# EAGLE design RGB_i2c_v1plusRTC (EAGLE 6.5.0)
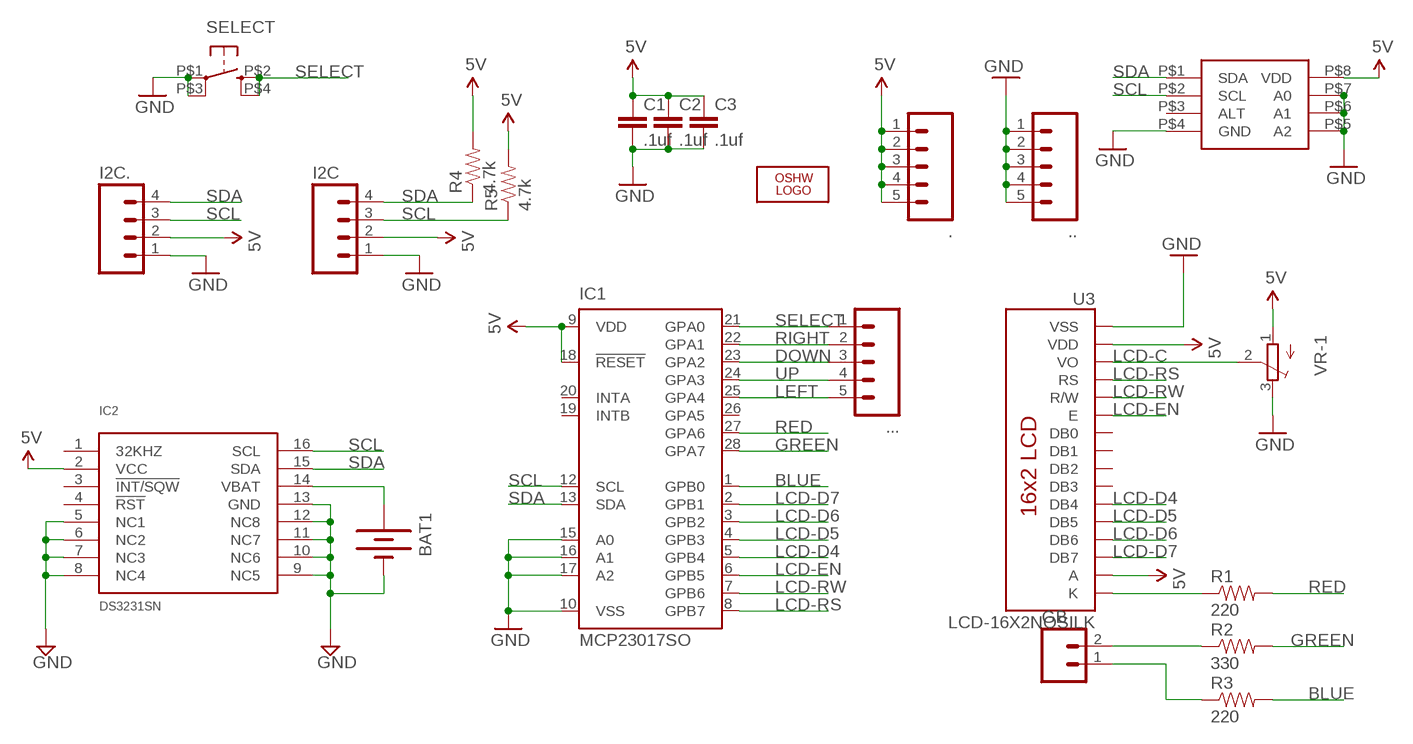
[diagram p0: schematic, sheet 1]

## Parts
.  M05LOCK  [1X05_LOCK]
..  M05LOCK  [1X05_LOCK]
...  M05LOCK  [1X05_LOCK]
BAT1  BATTERY12MM  [BATTCON_12MM]
C1  .1uf  CAP0805  [0805]
C2  .1uf  CAP0805  [0805]
C3  .1uf  CAP0805  [0805]
GB  M02LOCK  [1X02_LOCK]
I2C  M04LOCK  [1X04_LOCK]
I2C.  M04LOCK  [1X04_LOCK]
IC1  MCP23017SO  [SO28W]
IC2  DS3231SN  [SO16W]
IC3  MCP9808  [MSOP8]
LOGO2  OSHW_LOGO_10MILX0350-NT  [OSHW_10X350_NOTEXT]
R1  220  RESISTOR0805-RES  [0805]
R2  330  RESISTOR0805-RES  [0805]
R3  220  RESISTOR0805-RES  [0805]
R4  4.7k  RESISTOR0805-RES  [0805]
R5  4.7k  RESISTOR0805-RES  [0805]
SELECT  KMR211GLFS  BUTTON-KMR241GLFS  [PUSHBUTTON-KMR241GLFS]
U3  LCD-16X2NOSILK  [LCD-16X2_NOSILK]
VR-1  TRIMPOTTC33X  [TC33X]

## Nets
5V: ..1 ..2 ..3 ..4 ..5 C1.1 C2.1 C3.1 I2C.2 I2C..2 IC1.9(VDD) IC1.18(!RESET) IC2.2(VCC) IC3.P$8(VDD) R4.2 R5.2 U3.2(VDD) U3.15(A) VR-1.1(A)
BLUE: IC1.1(GPB0) R3.2
DOWN: ....3 IC1.23(GPA2)
GND: ...1 ...2 ...3 ...4 ...5 BAT1.GND(-) C1.2 C2.2 C3.2 I2C.1 I2C..1 IC1.10(VSS) IC1.15(A0) IC1.16(A1) IC1.17(A2) IC2.5(NC1) IC2.6(NC2) IC2.7(NC3) IC2.8(NC4) IC2.9(NC5) IC2.10(NC6) IC2.11(NC7) IC2.12(NC8) IC2.13(GND) IC3.P$4(GND) SELECT.P$1 SELECT.P$3 U3.1(VSS) VR-1.3(E)
GREEN: IC1.28(GPA7) R2.2
LCD-C: U3.3(VO) VR-1.2(S)
LCD-D4: IC1.5(GPB4) U3.11(DB4)
LCD-D5: IC1.4(GPB3) U3.12(DB5)
LCD-D6: IC1.3(GPB2) U3.13(DB6)
LCD-D7: IC1.2(GPB1) U3.14(DB7)
LCD-EN: IC1.6(GPB5) U3.6(E)
LCD-RS: IC1.8(GPB7) U3.4(RS)
LCD-RW: IC1.7(GPB6) U3.5(R/W)
LEFT: ....5 IC1.25(GPA4)
N$1: GB.2 R2.1
N$2: GB.1 R3.1
N$3: BAT1.PWR@1(+) IC2.14(VBAT)
N$4: R1.1 U3.16(K)
N$6: IC3.P$5(A2) IC3.P$6(A1) IC3.P$7(A0) ; supply symbol labelled GND
RED: IC1.27(GPA6) R1.2
RIGHT: ....2 IC1.22(GPA1)
SCL: I2C.3 I2C..3 IC1.12(SCL) IC2.16(SCL) IC3.P$2(SCL) R5.1
SDA: I2C.4 I2C..4 IC1.13(SDA) IC2.15(SDA) IC3.P$1(SDA) R4.1
SELECT: ....1 IC1.21(GPA0) SELECT.P$2 SELECT.P$4
UP: ....4 IC1.24(GPA3)
Unconnected: IC1.19(INTB) IC1.20(INTA) IC1.26(GPA5) IC2.1(32KHZ) IC2.3(!INT/SQW) IC2.4(!RST) IC3.P$3(ALT) U3.7(DB0) U3.8(DB1) U3.9(DB2) U3.10(DB3)

## Library data of the parts
. .. ... = SparkFun:M05: Header 5 Standard 5-pin 0.1" header. Use with straight break away headers (SKU : PRT-00116), right angle break away headers (PRT-00553), swiss pins (PRT-00743), machine pins (PRT-00117), and female headers (PRT-00115). Molex polarized connector foot print use with SKU : PRT-08230 with associated crimp pins and housings.
BAT1 = SparkFun:BATTERY: Battery Holders Various common sizes : AA, AAA, 20mm coin cell and 12mm coin cell.
C1-C3 = SparkFun:CAP: Capacitor Standard 0603 ceramic capacitor, and 0.1" leaded capacitor.
GB = SparkFun:M02: Header 2 Standard 2-pin 0.1" header. Use with straight break away headers (SKU : PRT-00116), right angle break away headers (PRT-00553), swiss pins (PRT-00743), machine pins (PRT-00117), and female headers (PRT-00115). Molex polarized connector foot print use with SKU : PRT-08233 with associated crimp pins and housings.
I2C I2C. = SparkFun:M04: Header 4 Standard 4-pin 0.1" header. Use with straight break away headers (SKU : PRT-00116), right angle break away headers (PRT-00553), swiss pins (PRT-00743), machine pins (PRT-00117), and female headers (PRT-00115). Molex polarized connector foot print use with SKU : PRT-08231 with associated crimp pins and housings. 1MM SMD Version SKU: PRT-10208
IC1 = adafruit:MCP23017: http://ww1.microchip.com/downloads/en/DeviceDoc/21952a.pdf Source: http://ww1.microchip.com/downloads/en/DeviceDoc/21952a.pdf
IC2 = comfile:DS3231SN
IC3 = Qxd:MCP9808
LOGO2 = ohw-logo:OSHW_LOGO_10MIL
R1-R5 = SparkFun:RESISTOR: Resistor Basic schematic elements and footprints for 0603, 1206, and PTH resistors.
SELECT = okie:BUTTON-KMR241GLFS
U3 = SparkFun:LCD-16X2
VR-1 = adafruit:TRIMPOT: SMT trimmer potentiometer part number TC33X http://www.ladyada.net/library/eagle

## Board
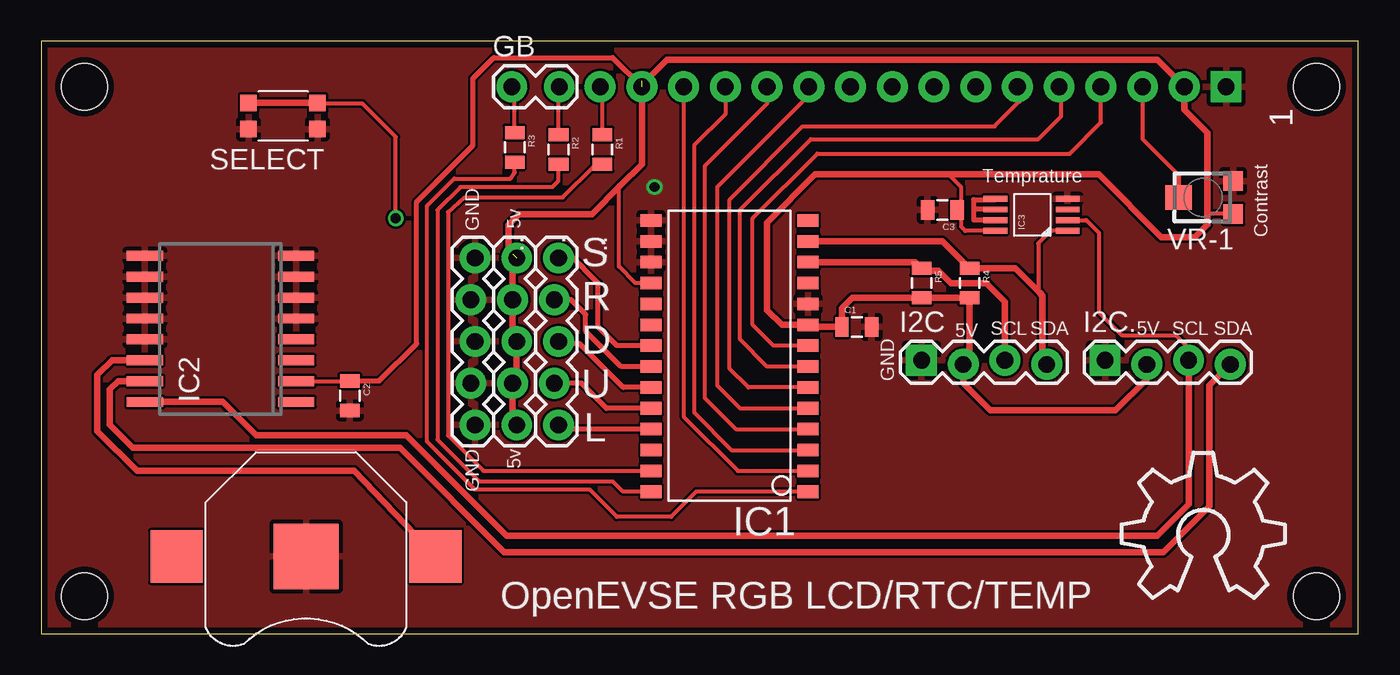
[diagram p1: board, top side]
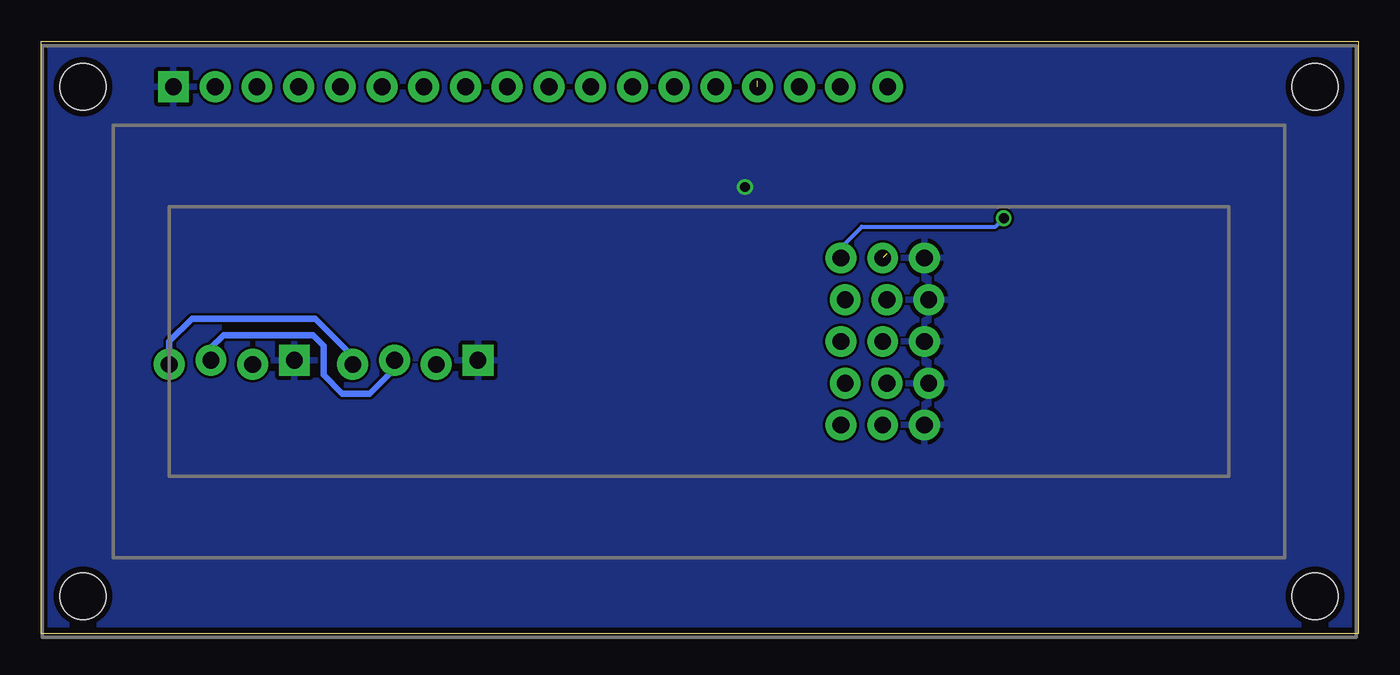
[diagram p2: board, bottom side, seen from below]

Size 80.19 x 36.06 mm. Coordinates in mm from the lower left corner, seen from the top.
Outline: 0,0 80.19,0 80.19,36.06 0,36.06 0,0
Copper layers (1*16): Top 0.0356mm / dielectric 1.5011mm / Bottom 0.0356mm
Design rules "default": minimum track width 6mil, minimum drill 13mil, track to track 6mil, track to pad 6mil, pad to pad 6mil, via to via 6mil, smd to smd 6mil, copper to edge 15mil, drill to drill 6mil, minimum pad ring 7mil, minimum via ring 7mil, stop-mask expansion 4mil, vias tented up to drill 0mil, thermal gap 10mil

### Footprints (pad centres in the part's own frame; a part is rotated, then mirrored left to right if it is on the bottom)
1X05_LOCK = drill 1.016 pad 1.88: 1 0,0.127; 2 2.54,-0.127; 3 5.08,0.127; 4 7.62,-0.127; 5 10.16,0.127
BATTCON_12MM = smd 3.962 x 3.962: GND 0,0 | smd 3.175 x 3.175: PWR@1 -7.874,0; PWR@2 7.874,0
0805 = smd 0.8 x 1.2: 1 -0.9,0; 2 0.9,0
1X02_LOCK = drill 1.016 pad 1.88: 1 -0.178,0; 2 2.718,0
1X04_LOCK = drill 1.016 pad 1.88 square: 1 0,0.127 | drill 1.016 pad 1.88: 2 2.54,-0.127; 3 5.08,0.127; 4 7.62,-0.127
SO28W = smd 0.762 x 1.27: 1 -7.62,-4.78; 2 -6.35,-4.78; 3 -5.08,-4.78; 4 -3.81,-4.78; 5 -2.54,-4.78; 6 -1.27,-4.78; 7 0,-4.78; 8 1.27,-4.78; 9 2.54,-4.78; 10 3.81,-4.78; 11 5.08,-4.78; 12 6.35,-4.78; 13 7.62,-4.78; 14 8.89,-4.78; 15 8.89,4.78; 16 7.62,4.78; 17 6.35,4.78; 18 5.08,4.78; 19 3.81,4.78; 20 2.54,4.78; 21 1.27,4.78; 22 0,4.78; 23 -1.27,4.78; 24 -2.54,4.78; 25 -3.81,4.78; 26 -5.08,4.78; 27 -6.35,4.78; 28 -7.62,4.78
SO16W = smd 0.6 x 2.2: 1 -4.445,-4.6; 2 -3.175,-4.6; 3 -1.905,-4.6; 4 -0.635,-4.6; 5 0.635,-4.6; 6 1.905,-4.6; 7 3.175,-4.6; 8 4.445,-4.6; 9 4.445,4.6; 10 3.175,4.6; 11 1.905,4.6; 12 0.635,4.6; 13 -0.635,4.6; 14 -1.905,4.6; 15 -3.175,4.6; 16 -4.445,4.6
MSOP8 = smd 0.35 x 1.45: P$1 0,0; P$2 0.65,0; P$3 1.3,0; P$4 1.95,0; P$5 1.95,4.4; P$6 1.3,4.4; P$7 0.65,4.4; P$8 0,4.4
PUSHBUTTON-KMR241GLFS = smd 1 x 1: P$1 2.1,0.8; P$2 2.1,-0.8; P$3 -2.1,0.8; P$4 -2.1,-0.8
LCD-16X2_NOSILK = drill 1.016 pad 1.88 square: 1 -32,15.5 | drill 1.016 pad 1.88: 2 -29.46,15.5; 3 -26.92,15.5; 4 -24.38,15.5; 5 -21.84,15.5; 6 -19.3,15.5; 7 -16.76,15.5; 8 -14.22,15.5; 9 -11.68,15.5; 10 -9.14,15.5; 11 -6.6,15.5; 12 -4.06,15.5; 13 -1.52,15.5; 14 1.02,15.5; 15 3.56,15.5; 16 6.1,15.5 | hole 2.8: -37.5,15.5; -37.5,-15.5; 37.5,15.5; 37.5,-15.5
TC33X = smd 1.2 x 1.2: 1 -1,-1.825; 3 1,-1.825 | smd 1.5 x 1.6: 2 0,1.5

### Placement (x,y rotation side)
.  28.83,22.86 270 top
..  26.29,22.86 270 top
...  31.37,22.86 270 top
BAT1  16.13,4.7 180 top
C1  49.66,18.67 0 top
C2  18.8,14.48 270 top
C3  54.86,25.78 180 top
GB  28.83,33.27 0 top
I2C  53.59,16.51 0 top
I2C.  64.77,16.51 0 top
IC1  41.91,16.26 90 top
IC2  10.92,18.54 90 top
IC3  62.48,24.51 90 top
LOGO2  65.79,2.16 0 top
R1  34.16,29.46 270 top
R2  31.5,29.46 270 top
R3  28.83,29.59 270 top
R4  56.52,21.34 270 top
R5  53.59,21.34 270 top
SELECT  14.73,31.5 180 top
U3  40.13,17.78 0 bottom
VR-1  70.74,26.54 90 top

### Tracks (layer width: path | path; a pad name or v marks a point on that pad's centre or on a via)
5V  (2 unrouted)
  Top 0.254: 56.52,16.64 I2C.2 56.26,16.13 | 70.99,25.4 71.14,25.54 VR-1.1 | 28.96,23.37 28.7,23.11 28.7,23.62 | 46.82,18.67 IC1.9 | IC1.18 36.2,21.34 35.18,22.35 35.18,27.3 35.24,27.24 | IC2.2 18.79,15.37 C2.1 | IC3.P$8 56.26,24.51 56.01,24.77 56.01,25.78 | 56.01,25.78 56.01,27.18 55.24,27.94 | C3.1 56.01,25.78
  Top 0.305: C2.1 20.59,15.38 22.86,17.65 22.86,26.29 26.29,29.72 26.29,33.78 27.56,35.05 34.8,35.05 U3.15
  Top 0.406: 56.52,16.64 R4.2 R5.2 49.4,20.45 48.76,19.8 C1.1 46.82,18.67 | 36.57,33.65 36.83,33.65 38.1,34.92 67.95,34.92 U3.2 69.6,31.88 70.99,30.48 70.99,25.4 70.99,24.89 70.23,24.13 68.2,24.13 64.39,27.94 55.24,27.94 47.12,27.94 44.2,25.02 44.2,19.68 45.09,18.8 IC1.9 | 28.7,23.11 ..2 28.7,18.03 ..3 28.96,15.49 ..4 28.7,12.95 ..5 28.83,12.57 | U3.15 36.57,28.57 35.24,27.24 33.53,25.53 29.08,25.53 28.45,24.89 28.45,23.37 ..1 | I2C..2 67.31,15.49 65.41,13.59 57.78,13.59 56.13,15.24 I2C.2
BLUE
  Top 0.254: IC1.1 39.88,8.64 38.35,7.11 35.05,7.11 33.4,8.76 26.42,8.76 23.5,11.68 23.5,26.04 25.15,27.69 28.57,27.69 28.83,28.07 R3.2
DOWN
  Top 0.305: IC1.23 35.43,14.99 32.77,17.65 31.62,17.65 ....3
GND  (via drill 0.6)
  other vias: 37.34,27.18
  pour Top: -9.14,-11.05 94.23,-13.97 94.23,53.34 -8.64,53.34
  pour Bottom: -6.35,-5.84 85.85,-4.45 85.85,45.34 -6.35,43.94
GREEN
  Top 0.254: R2.2 31.5,27.56 31.11,27.18 25.53,27.18 24.13,25.78 24.13,11.81 26.67,9.27 34.8,9.27 35.43,8.64 IC1.28
LCD-C
  Top 0.254: 69.24,27.92 67.06,30.1 U3.3
  Top 0.305: U3.3 | 69.24,27.92 VR-1.2
LCD-D4
  Top 0.254: U3.11 46.73,32.76 41.15,27.18 41.15,15.11 42.55,13.72 IC1.5
LCD-D5
  Top 0.254: U3.12 44.19,32.25 40.39,28.45 40.39,14.35 42.29,12.45 IC1.4
LCD-D6
  Top 0.254: U3.13 41.65,31.62 39.75,29.72 39.75,13.46 42.04,11.18 IC1.3
LCD-D7
  Top 0.254: U3.14 39.11,13.21 42.42,9.91 IC1.2
LCD-EN
  Top 0.254: IC1.6 43.05,14.99 41.91,16.13 41.91,26.42 46.35,30.86 58.04,30.86 59.56,32.38 59.56,33.15 U3.6
LCD-RS
  Top 0.254: IC1.8 44.58,17.53 43.31,18.8 43.31,25.27 47.24,29.21 62.61,29.21 64.52,31.11 U3.4
LCD-RW
  Top 0.254: IC1.7 44.2,16.26 42.55,17.91 42.55,25.78 46.86,30.1 60.71,30.1 62.1,31.5 62.1,33.15 U3.5
LEFT
  Top 0.305: IC1.25 31.75,12.45 ....5
N$1
  Top 0.254: R2.1 31.5,33.22 GB.2
N$2
  Top 0.254: R3.1 28.83,33.1 GB.1
N$3
  Top 0.406: IC2.14 4.32,16.64 3.43,15.75 3.43,12.32 5.84,9.91 19.05,9.91 BAT1.PWR@1
N$4
  Top 0.254: R1.1 34.16,33.15 U3.16
N$6
  Top 0.305: IC3.P$7 56.77,25.16 56.77,25.78 56.77,25.81 | 56.77,25.81 56.77,26.42 58.08,26.42 IC3.P$5 | IC3.P$6 56.77,25.81
RED
  Top 0.254: 33.77,28.56 R1.2 34.05,28.45 33.66,28.45 31.75,26.54 25.78,26.54 24.77,25.65 24.77,12.06 26.92,9.91 IC1.27
RIGHT
  Top 0.305: IC1.22 35.31,16.26 33.15,18.41 33.15,19.43 32.26,20.32 ....2
SCL
  Top 0.254: 69.79,16.7 I2C..3 69.66,16.83 69.66,17.59 69.09,18.16 65.79,18.16 64.39,19.56 64.39,24.38 63.61,25.16 IC3.P$2
  Top 0.406: IC1.12 53.22,22.61 R5.1 53.73,22.1 54.61,22.1 55.37,21.34 57.53,21.34 58.67,20.19 I2C.3 | IC2.16 11.05,14.1 13.08,12.06 22.23,12.06 28.32,5.97 67.94,5.97 69.85,7.87 I2C..3
  Bottom 0.406: I2C.3 58.67,16.13 60.2,14.61 61.85,14.61 62.99,15.75 62.99,17.53 63.63,18.16 69.09,18.16 69.85,17.4 I2C..3
SDA
  Top 0.254: IC3.P$1 61.47,24.51 60.71,23.75 60.71,20.83 60.77,20.77
  Top 0.406: IC1.13 54.88,23.88 R4.1 59.3,22.24 60.77,20.77 60.96,20.57 60.96,16.64 I2C.4 | IC2.15 4.7,15.37 4.19,14.86 4.19,12.7 5.59,11.3 21.84,11.3 28.19,4.95 68.33,4.95 71.12,7.75 71.12,15.11 I2C..4
  Bottom 0.406: I2C.4 61.21,16.89 63.5,19.18 70.99,19.18 72.39,17.78 I2C..4
SELECT  (via drill 0.6)
  Top 0.254: v21.59,25.27 21.59,30.23 19.56,32.26 16.87,32.26 SELECT.P$4
  Top 0.305: IC1.21 35.05,17.53 33.91,18.67 33.91,21.34 32.26,22.99 31.62,22.99 ....1
  Top 0.406: SELECT.P$2 SELECT.P$4
  Bottom 0.254: ....1 31.5,23.5 30.23,24.77 22.1,24.77 v21.59,25.27
UP
  Top 0.305: IC1.24 34.42,13.72 32.89,15.24 ....4

### Text on the board
tNames: 1 | Temprature | GND | 5v | Contrast | S | R | 5V | SCL | SDA | 5V | SCL | SDA | D | GND | U | L | 5v | GND | OpenEVSE RGB LCD/RTC/TEMP